# Altium schematic sheet fire_filter.SchDoc
size A
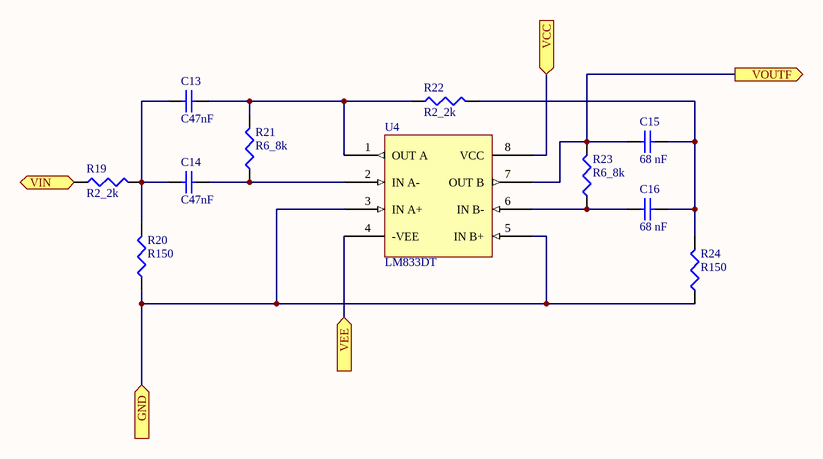
[diagram p0: fire_filter.SchDoc]

## Parts
C13  C47nF  [C0603]
C14  C47nF  [C0603]
C15  68 nF  [C0603]
C16  68 nF  [C0603]
R19  R2_2k  [R0603]
R20  R150  [R0603]
R21  R6_8k  [R0603]
R22  R2_2k  [R0603]
R23  R6_8k  [R0603]
R24  R150  [R0603]
U4  LM833DT  [soic8]

## Ports
GND (in), VCC (in), VEE (in), VIN (in), VOUTF (out)

## Nets
GND: R20.1 R24.1 U4.3(IN_A+) U4.5(IN_B+) ; port GND
VCC: U4.8(VCC) ; port VCC
VEE: U4.4(-VEE) ; port VEE
VIN: R19.1 ; port VIN
VOUTF: C15.1 R23.2 U4.7(OUT_B) ; port VOUTF
NetC13_1: C13.1 C14.1 R19.2 R20.2
NetC13_2: C13.2 R21.2 R22.1 U4.1(OUT_A)
NetC14_2: C14.2 R21.1 U4.2(IN_A-)
NetC15_2: C15.2 C16.2 R22.2 R24.2
NetC16_1: C16.1 R23.1 U4.6(IN_B-)

## Library data of the parts
C13 C14 = C47nF: 47 nF Surface Mount Capacitor; Manufacturer: Murata Electronics North America; Manufacturer Part Number: GRM188R71C473KA01D; Capacitance: 0.047µF; Tolerance: ±10%; Voltage - Rated: 16V; Temperature Coefficient: X7R; Supplier 1: Digi-Key; RoHS: RoHS Compliant; Category: Capacitors; Stock 1: 56351; Pricing 1: 1=0.1, 10=0.042, 50=0.0226, 100=0.0191, 250=0.01568, 500=0.0134, 1000=0.01044 (USD); Packaging: Digi-Reel®; Part Status: Active; Operating Temperature: -55°C ~ 125°C; Features: -; Ratings: -; Applications: General Purpose; Mounting Type: Surface Mount, MLCC; Package / Case: 0603 (1608 Metric); Size / Dimension: 0.063" L x 0.031" W (1.60mm x 0.80mm); Height - Seated (Max): -; Thickness (Max): 0.035" (0.90mm); Lead Spacing: -; Lead Style: -; ComponentLink1URL: http://www.murata.com/~/media/webrenewal/support/library/catalog/products/capacitor/mlcc/c02e.pdf; ComponentLink1Description: http://www.murata.com/~/media/webrenewal/support/library/catalog/products/capacitor/mlcc/c02e.pdf; Supplier Part Number 1: 490-1529-6-ND
C15 C16 = C68nF: 68 nF Surface Mount Capacitor; Manufacturer: Murata Electronics North America; Manufacturer Part Number: GRM188R71E683KA01D; Capacitance: 0.068µF; Tolerance: ±10%; Voltage - Rated: 25V; Temperature Coefficient: X7R; Supplier 1: Digi-Key; RoHS: RoHS Compliant; Category: Capacitors; Stock 1: 117781; Pricing 1: 1=0.1, 10=0.056, 50=0.0306, 100=0.0259, 250=0.02116, 500=0.0181, 1000=0.0141 (USD); Packaging: Digi-Reel®; Part Status: Active; Operating Temperature: -55°C ~ 125°C; Features: -; Ratings: -; Applications: General Purpose; Mounting Type: Surface Mount, MLCC; Package / Case: 0603 (1608 Metric); Size / Dimension: 0.063" L x 0.031" W (1.60mm x 0.80mm); Height - Seated (Max): -; Thickness (Max): 0.035" (0.90mm); Lead Spacing: -; Lead Style: -; ComponentLink1URL: http://www.murata.com/~/media/webrenewal/support/library/catalog/products/capacitor/mlcc/c02e.pdf; ComponentLink1Description: http://www.murata.com/~/media/webrenewal/support/library/catalog/products/capacitor/mlcc/c02e.pdf; Supplier Part Number 1: 490-1523-6-ND
R19 R22 = R2_2k: 2.2k Ohms Surface Mount Resistor; Manufacturer: Yageo; Manufacturer Part Number: RC0603FR-072K2L; Tolerance: ±1%; Power (Watts): 0.1W, 1/10W; Temperature Coefficient: ±100ppm/°C; Supplier 1: Digi-Key; RoHS: RoHS Compliant; Category: Resistors; Stock 1: 4524664; Pricing 1: 1=0.1, 10=0.013, 25=0.0092, 50=0.007, 100=0.0052, 250=0.00396, 500=0.00316, 1000=0.00233 (USD); Packaging: Digi-Reel®; Part Status: Active; Resistance (Ohms): 2.2k; Composition: Thick Film; Features: Moisture Resistant; Operating Temperature: -55°C ~ 155°C; Package / Case: 0603 (1608 Metric); Supplier Device Package: 0603; Size / Dimension: 0.063" L x 0.031" W (1.60mm x 0.80mm); Height - Seated (Max): 0.022" (0.55mm); Number of Terminations: 2; Failure Rate: -; ComponentLink1URL: http://www.yageo.com/NewPortal/yageodocoutput?fileName=/pdf/R-Chip/PYu-RC_Group_51_RoHS_L_4.pdf; ComponentLink1Description: http://www.yageo.com/NewPortal/yageodocoutput?fileName=/pdf/R-Chip/PYu-RC_Group_51_RoHS_L_4.pdf; Supplier Part Number 1: 311-2.20KHRDKR-ND
R20 R24 = R150: 150 Ohms Surface Mount Resistor; Manufacturer: Yageo; Manufacturer Part Number: RC0603FR-07150RL; Resistance (Ohms): 150; Tolerance: ±1%; Power (Watts): 0.1W, 1/10W; Temperature Coefficient: ±100ppm/°C; Supplier 1: Digi-Key; RoHS: RoHS Compliant; Category: Resistors; Stock 1: 875380; Pricing 1: 1=0.1, 10=0.013, 25=0.0092, 50=0.007, 100=0.0052, 250=0.00396, 500=0.00316, 1000=0.00233 (USD); Packaging: Digi-Reel®; Part Status: Active; Composition: Thick Film; Features: Moisture Resistant; Operating Temperature: -55°C ~ 155°C; Package / Case: 0603 (1608 Metric); Supplier Device Package: 0603; Size / Dimension: 0.063" L x 0.031" W (1.60mm x 0.80mm); Height - Seated (Max): 0.022" (0.55mm); Number of Terminations: 2; Failure Rate: -; ComponentLink1URL: http://www.yageo.com/NewPortal/yageodocoutput?fileName=/pdf/R-Chip/PYu-RC_Group_51_RoHS_L_4.pdf; ComponentLink1Description: http://www.yageo.com/NewPortal/yageodocoutput?fileName=/pdf/R-Chip/PYu-RC_Group_51_RoHS_L_4.pdf; Supplier Part Number 1: 311-150HRDKR-ND
R21 R23 = R6_8k: 6.8k Ohms Surface Mount Resistor; Manufacturer: Panasonic Electronic Components; Manufacturer Part Number: ERJ-3EKF6801V; Tolerance: ±1%; Power (Watts): 0.1W, 1/10W; Temperature Coefficient: ±100ppm/°C; Supplier 1: Digi-Key; RoHS: RoHS Compliant; Category: Resistors; Stock 1: 100612; Pricing 1: 1=0.1, 10=0.019, 25=0.0136, 50=0.0104, 100=0.0077, 250=0.00584, 500=0.00468, 1000=0.00345 (USD); Packaging: Cut Tape (CT); Part Status: Active; Resistance (Ohms): 6.8k; Composition: Thick Film; Features: Automotive AEC-Q200; Operating Temperature: -55°C ~ 155°C; Package / Case: 0603 (1608 Metric); Supplier Device Package: 0603; Size / Dimension: 0.063" L x 0.031" W (1.60mm x 0.80mm); Height - Seated (Max): 0.022" (0.55mm); Number of Terminations: 2; Failure Rate: -; ComponentLink1URL: https://industrial.panasonic.com/cdbs/www-data/pdf/RDA0000/AOA0000C283.pdf; ComponentLink1Description: https://industrial.panasonic.com/cdbs/www-data/pdf/RDA0000/AOA0000C283.pdf; Supplier Part Number 1: P6.80KHCT-ND
U4 = LM833DT: IC Dual Audio Amplifier; Manufacturer: STMicroelectronics; Number of Circuits: 2; Slew Rate: 7 V/µs; Gain Bandwidth Product: 15MHz; Current - Input Bias: 300nA; Voltage - Input Offset: 300µV; Current - Supply: 4mA; Voltage - Supply, Single/Dual (±): 5 V ~ 30 V, ±2.5 V ~ 15 V; Supplier 1: Digi-Key; Manufacturer Part Number: LM833DT; RoHS: RoHS Compliant; Category: Integrated Circuits (ICs); Stock 1: 35363; Pricing 1: 1=0.45, 10=0.382, 100=0.2855, 500=0.22434, 1000=0.17335 (USD); Packaging: Cut Tape (CT); Part Status: Active; Amplifier Type: Audio; Output Type: -; -3db Bandwidth: -; Current - Output / Channel: -; Operating Temperature: -40°C ~ 105°C; Mounting Type: Surface Mount; Package / Case: 8-SOIC (0.154", 3.90mm Width); Supplier Device Package: 8-SO; ComponentLink1URL: http://www.st.com/content/ccc/resource/technical/document/datasheet/3b/52/12/a5/70/7c/44/0a/CD00000470.pdf/files/CD00000470.pdf/jcr:content/translations/en.CD00000470.pdf; ComponentLink1Description: http://www.st.com/content/ccc/resource/technical/document/datasheet/3b/52/12/a5/70/7c/44/0a/CD00000470.pdf/files/CD00000470.pdf/jcr:content/translations/en.CD00000470.pdf; Supplier Part Number 1: 497-1597-1-ND